# EAGLE design IOPROTO96 (EAGLE 9.4.2)
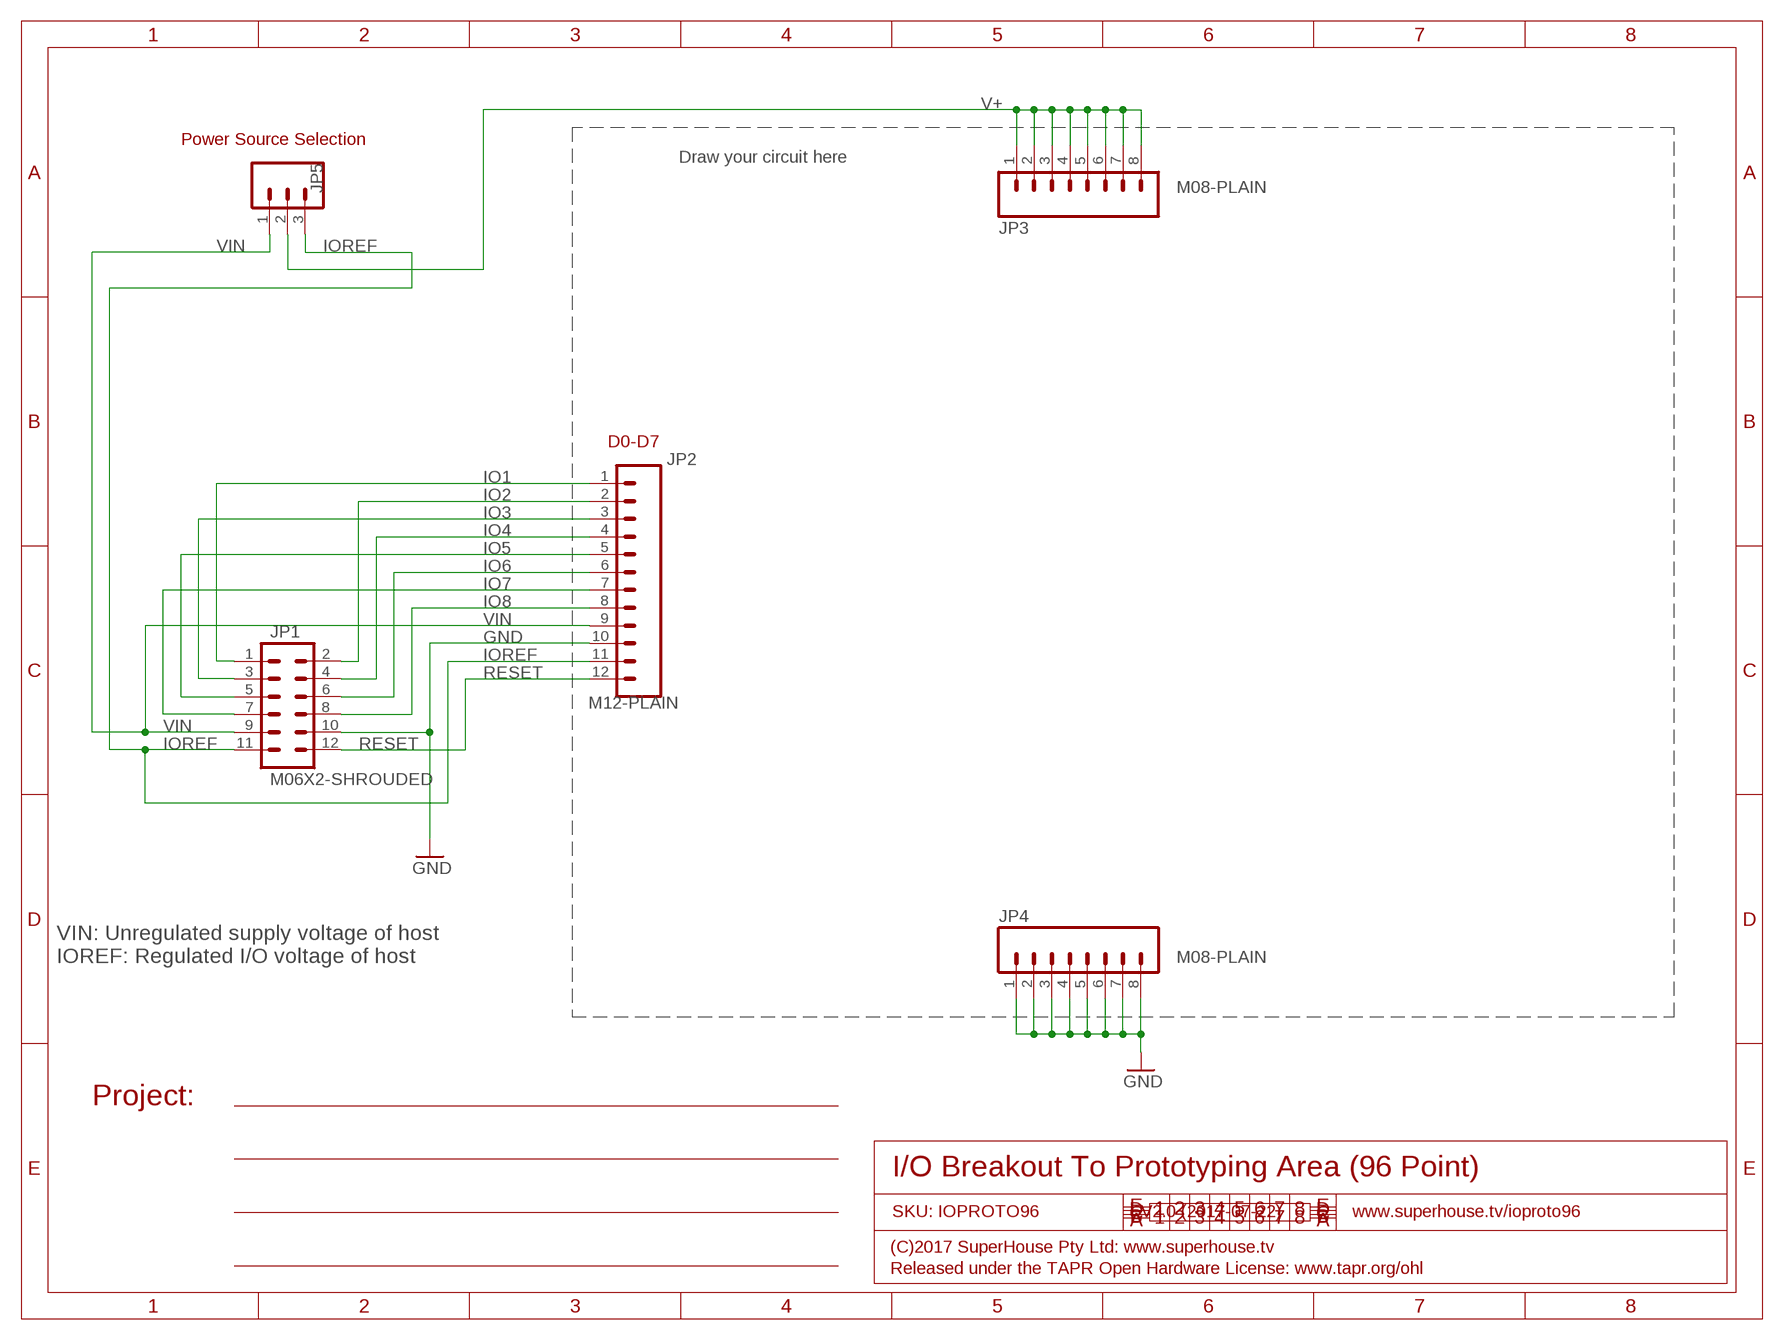
[diagram p0: schematic, sheet 1]

## Parts
JP1  M06X2-SHROUDED  [2X6-SHROUDED]
JP2  M12-PLAIN  [1X12]
JP3  M08-PLAIN  [1X08]
JP4  M08-PLAIN  [1X08]
JP5  M03-PIN  [1X03-P]

## Nets
GND: JP1.10 JP2.10 JP4.1 JP4.2 JP4.3 JP4.4 JP4.5 JP4.6 JP4.7 JP4.8
IO1: JP1.1 JP2.1
IO2: JP1.2 JP2.2
IO3: JP1.3 JP2.3
IO4: JP1.4 JP2.4
IO5: JP1.5 JP2.5
IO6: JP1.6 JP2.6
IO7: JP1.7 JP2.7
IO8: JP1.8 JP2.8
IOREF: JP1.11 JP2.11 JP5.3
RESET: JP1.12 JP2.12
V+: JP3.1 JP3.2 JP3.3 JP3.4 JP3.5 JP3.6 JP3.7 JP3.8 JP5.2
VIN: JP1.9 JP2.9 JP5.1

## Notes on the sheet
- Power Source Selection
- Draw your circuit here
- D0-D7
- VIN: Unregulated supply voltage of host
  IOREF: Regulated I/O voltage of host
- Project:
- I/O Breakout To Prototyping Area (96 Point)
- SKU: IOPROTO96 | V2.0 (2017-07-22) | www.superhouse.tv/ioproto96
- (C)2017 SuperHouse Pty Ltd: www.superhouse.tv
- Released under the TAPR Open Hardware License: www.tapr.org/ohl

## Library data of the parts
JP1 = SuperHouse-Connectors:M06X2: M12 header in 2x6 format
JP2 = SuperHouse-Connectors:M12: 12-way header
JP3 JP4 = SuperHouse-Connectors:M08
JP5 = SuperHouse-Connectors:M03: Header 1x5 Standard 0.1" header.

## Board
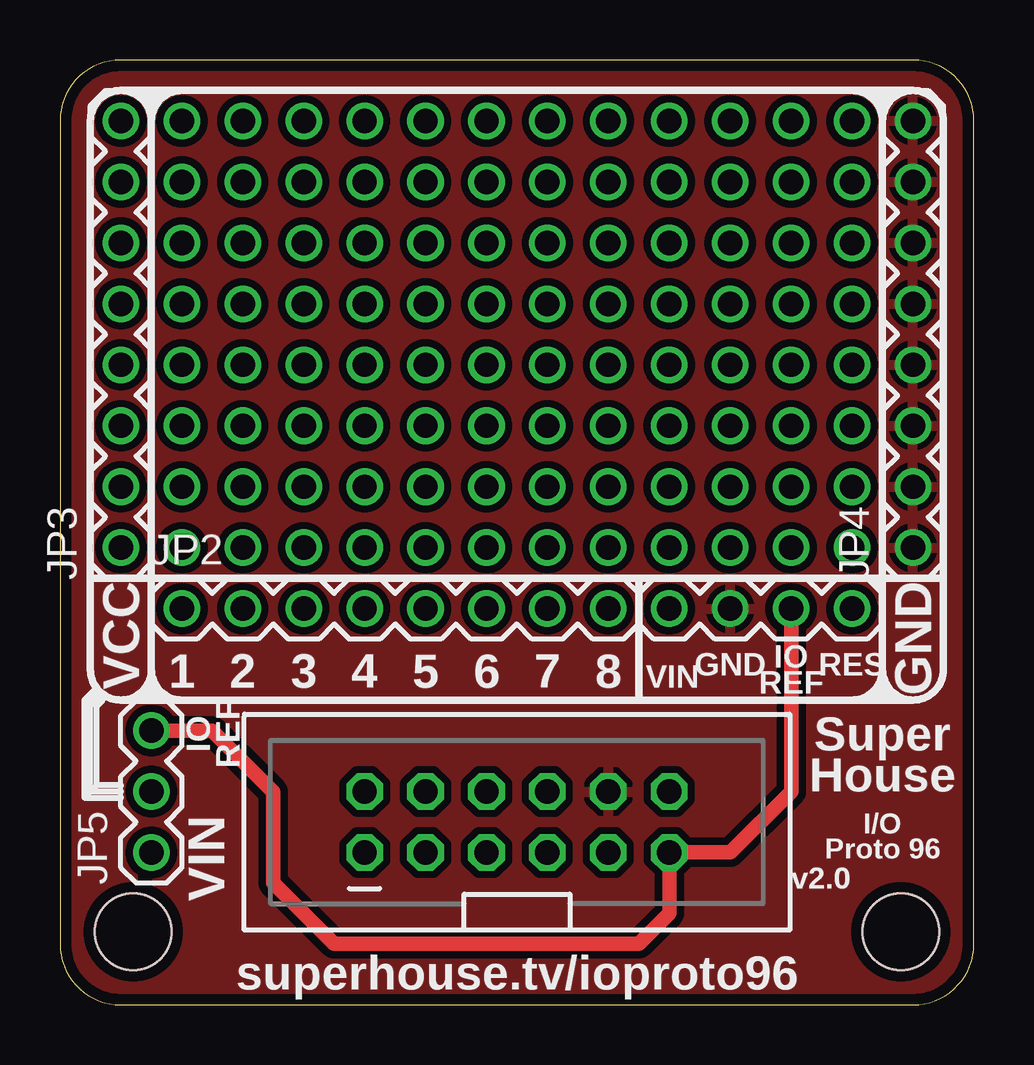
[diagram p1: board, top side]
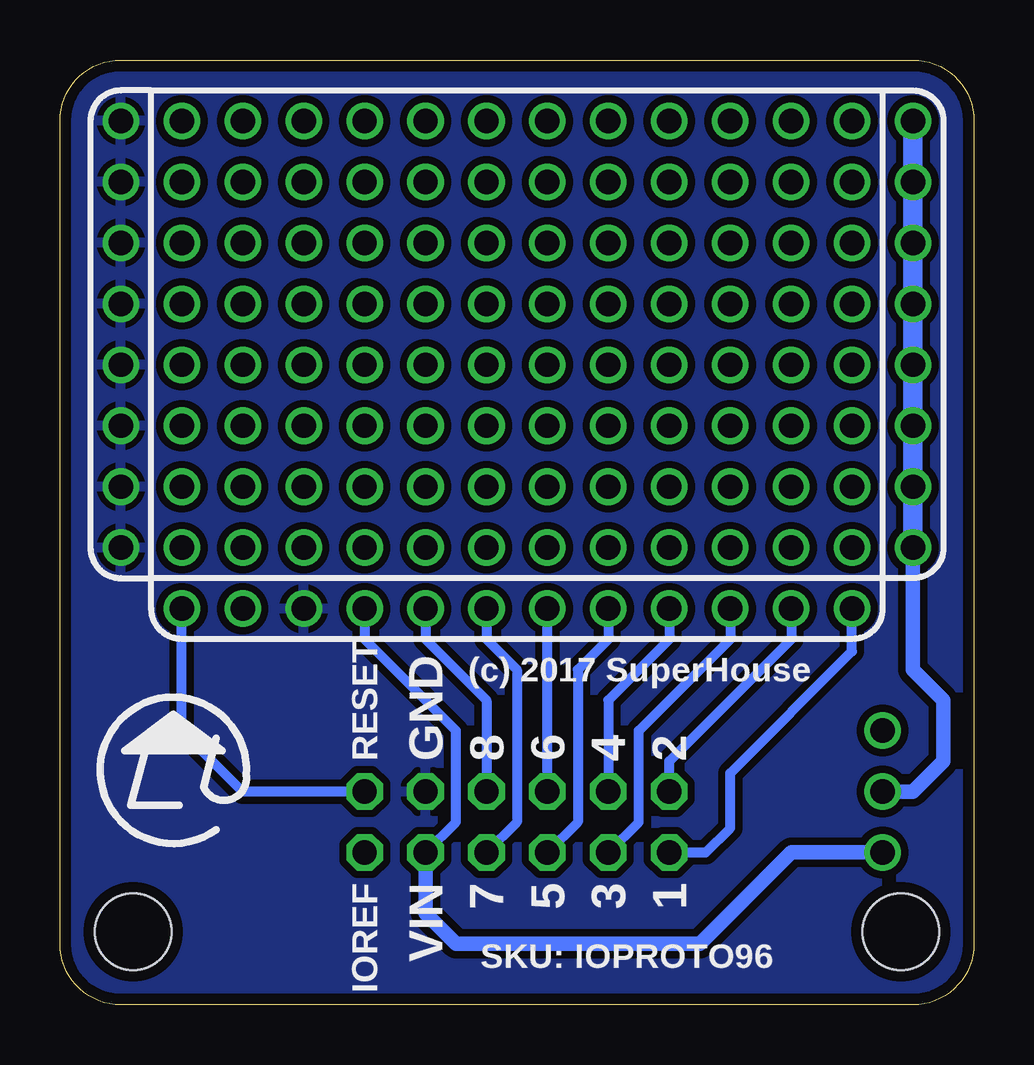
[diagram p2: board, bottom side, seen from below]

Size 38.1 x 39.37 mm. Coordinates in mm from the lower left corner, seen from the top.
Outline: 0,2.54 arc90 2.54,0 35.56,0 arc90 38.1,2.54 38.1,36.83 arc90 35.56,39.37 2.54,39.37 arc90 0,36.83 0,2.54
Copper layers (1*16): Top 0.035mm / dielectric 1.5mm / Bottom 0.035mm
Design rules "default *": minimum track width 10mil, minimum drill 24mil, track to track 12mil, track to pad 12mil, pad to pad 12mil, via to via 12mil, smd to smd 8mil, copper to edge 18mil, drill to drill 8mil, minimum pad ring 10mil, minimum via ring 6mil, stop-mask expansion 4mil, vias tented up to drill 25mil, thermal gap 10mil
Holes 3.2 mm at 35.05,3.05 3.05,3.05

### Footprints (pad centres in the part's own frame; a part is rotated, then mirrored left to right if it is on the bottom)
2X6-SHROUDED = drill 1.016 octagon: 1 0,0; 2 2.54,0; 3 0,-2.54; 4 2.54,-2.54; 5 0,-5.08; 6 2.54,-5.08; 7 0,-7.62; 8 2.54,-7.62; 9 0,-10.16; 10 2.54,-10.16; 11 0,-12.7; 12 2.54,-12.7
1X12 = drill 1.016: 1 0,0; 2 2.54,0; 3 5.08,0; 4 7.62,0; 5 10.16,0; 6 12.7,0; 7 15.24,0; 8 17.78,0; 9 20.32,0; 10 22.86,0; 11 25.4,0; 12 27.94,0
1X08 = drill 1.016: 1 0,0; 2 2.54,0; 3 5.08,0; 4 7.62,0; 5 10.16,0; 6 12.7,0; 7 15.24,0; 8 17.78,0
1X03-P = drill 1.016: 1 0,0; 2 2.54,0; 3 5.08,0

### Placement (x,y rotation side)
JP1  12.7,6.35 90 top
JP2  5.08,16.51 0 top
JP3  2.54,19.05 90 top
JP4  35.56,19.05 90 top
JP5  3.81,6.35 90 top

### Tracks (layer width: path | path; a pad name or v marks a point on that pad's centre or on a via)
GND
  pour Bottom: 0,36.83 arc-90 2.54,39.37 35.56,39.37 arc-90 38.1,36.83 38.1,2.54 arc-90 35.56,0 2.54,0 arc-90 0,2.54
  pour Top: 0,36.83 arc-90 2.54,39.37 35.56,39.37 arc-90 38.1,36.83 38.1,2.54 arc-90 35.56,0 2.54,0 arc-90 0,2.54
IO1
  Bottom 0.406: JP1.1 11.18,6.35 10.16,7.37 10.16,9.65 5.08,14.73 JP2.1
IO2
  Bottom 0.406: JP1.2 12.7,10.16 7.62,15.24 JP2.2
IO3
  Bottom 0.406: JP1.3 13.97,7.62 13.97,11.43 10.16,15.24 JP2.3
IO4
  Bottom 0.406: JP2.4 12.7,15.24 15.24,12.7 JP1.4
IO5
  Bottom 0.406: JP1.5 16.51,7.62 16.51,13.97 15.24,15.24 JP2.5
IO6
  Bottom 0.406: JP1.6 JP2.6
IO7
  Bottom 0.406: JP1.7 19.05,7.62 19.05,13.97 20.32,15.24 JP2.7
IO8
  Bottom 0.406: JP2.8 22.86,15.24 20.32,12.7 JP1.8
IOREF
  Top 0.61: JP2.11 30.48,8.89 27.94,6.35 JP1.11 25.4,3.81 24.13,2.54 11.43,2.54 8.89,5.08 8.89,8.89 6.35,11.43 JP5.3
N$1  (via drill 1.02)
  other vias: 5.08,19.05
N$2  (via drill 1.02)
  other vias: 10.16,19.05
N$3  (via drill 1.02)
  other vias: 12.7,19.05
N$4  (via drill 1.02)
  other vias: 15.24,19.05
N$5  (via drill 1.02)
  other vias: 17.78,19.05
N$6  (via drill 1.02)
  other vias: 20.32,19.05
N$7  (via drill 1.02)
  other vias: 22.86,19.05
N$8  (via drill 1.02)
  other vias: 25.4,19.05
N$9  (via drill 1.02)
  other vias: 27.94,19.05
N$10  (via drill 1.02)
  other vias: 30.48,19.05
N$15  (via drill 1.02)
  other vias: 27.94,21.59
N$16  (via drill 1.02)
  other vias: 25.4,21.59
N$17  (via drill 1.02)
  other vias: 22.86,21.59
N$18  (via drill 1.02)
  other vias: 20.32,21.59
N$19  (via drill 1.02)
  other vias: 17.78,21.59
N$20  (via drill 1.02)
  other vias: 15.24,21.59
N$21  (via drill 1.02)
  other vias: 12.7,21.59
N$22  (via drill 1.02)
  other vias: 10.16,21.59
N$23  (via drill 1.02)
  other vias: 10.16,24.13
N$24  (via drill 1.02)
  other vias: 12.7,24.13
N$25  (via drill 1.02)
  other vias: 15.24,24.13
N$26  (via drill 1.02)
  other vias: 17.78,24.13
N$31  (via drill 1.02)
  other vias: 20.32,24.13
N$32  (via drill 1.02)
  other vias: 22.86,24.13
N$33  (via drill 1.02)
  other vias: 25.4,24.13
N$34  (via drill 1.02)
  other vias: 27.94,24.13
N$35  (via drill 1.02)
  other vias: 30.48,24.13
N$36  (via drill 1.02)
  other vias: 30.48,21.59
N$37  (via drill 1.02)
  other vias: 30.48,26.67
N$38  (via drill 1.02)
  other vias: 30.48,29.21
N$39  (via drill 1.02)
  other vias: 30.48,31.75
N$40  (via drill 1.02)
  other vias: 30.48,34.29
N$41  (via drill 1.02)
  other vias: 27.94,34.29
N$42  (via drill 1.02)
  other vias: 27.94,31.75
N$43  (via drill 1.02)
  other vias: 27.94,29.21
N$44  (via drill 1.02)
  other vias: 27.94,26.67
N$45  (via drill 1.02)
  other vias: 25.4,26.67
N$46  (via drill 1.02)
  other vias: 22.86,26.67
N$47  (via drill 1.02)
  other vias: 20.32,26.67
N$48  (via drill 1.02)
  other vias: 17.78,26.67
N$49  (via drill 1.02)
  other vias: 15.24,26.67
N$50  (via drill 1.02)
  other vias: 12.7,26.67
N$51  (via drill 1.02)
  other vias: 10.16,26.67
N$52  (via drill 1.02)
  other vias: 7.62,26.67
N$53  (via drill 1.02)
  other vias: 7.62,24.13
N$54  (via drill 1.02)
  other vias: 7.62,21.59
N$55  (via drill 1.02)
  other vias: 7.62,29.21
N$56  (via drill 1.02)
  other vias: 7.62,31.75
N$57  (via drill 1.02)
  other vias: 7.62,34.29
N$58  (via drill 1.02)
  other vias: 10.16,34.29
N$59  (via drill 1.02)
  other vias: 12.7,34.29
N$60  (via drill 1.02)
  other vias: 15.24,34.29
N$61  (via drill 1.02)
  other vias: 17.78,34.29
N$62  (via drill 1.02)
  other vias: 20.32,34.29
N$63  (via drill 1.02)
  other vias: 22.86,34.29
N$64  (via drill 1.02)
  other vias: 25.4,34.29
N$65  (via drill 1.02)
  other vias: 25.4,31.75
N$66  (via drill 1.02)
  other vias: 25.4,29.21
N$67  (via drill 1.02)
  other vias: 22.86,29.21
N$68  (via drill 1.02)
  other vias: 20.32,29.21
N$69  (via drill 1.02)
  other vias: 17.78,29.21
N$70  (via drill 1.02)
  other vias: 15.24,29.21
N$71  (via drill 1.02)
  other vias: 12.7,29.21
N$72  (via drill 1.02)
  other vias: 10.16,29.21
N$73  (via drill 1.02)
  other vias: 10.16,31.75
N$74  (via drill 1.02)
  other vias: 12.7,31.75
N$75  (via drill 1.02)
  other vias: 15.24,31.75
N$76  (via drill 1.02)
  other vias: 17.78,31.75
N$77  (via drill 1.02)
  other vias: 20.32,31.75
N$78  (via drill 1.02)
  other vias: 22.86,31.75
N$79  (via drill 1.02)
  other vias: 7.62,36.83
N$80  (via drill 1.02)
  other vias: 10.16,36.83
N$81  (via drill 1.02)
  other vias: 12.7,36.83
N$82  (via drill 1.02)
  other vias: 15.24,36.83
N$83  (via drill 1.02)
  other vias: 17.78,36.83
N$84  (via drill 1.02)
  other vias: 20.32,36.83
N$85  (via drill 1.02)
  other vias: 22.86,36.83
N$86  (via drill 1.02)
  other vias: 25.4,36.83
N$87  (via drill 1.02)
  other vias: 27.94,36.83
N$88  (via drill 1.02)
  other vias: 30.48,36.83
N$89  (via drill 1.02)
  other vias: 33.02,36.83
N$90  (via drill 1.02)
  other vias: 33.02,34.29
N$91  (via drill 1.02)
  other vias: 33.02,31.75
N$92  (via drill 1.02)
  other vias: 33.02,29.21
N$93  (via drill 1.02)
  other vias: 33.02,26.67
N$94  (via drill 1.02)
  other vias: 33.02,24.13
N$95  (via drill 1.02)
  other vias: 33.02,21.59
N$96  (via drill 1.02)
  other vias: 33.02,19.05
N$97  (via drill 1.02)
  other vias: 5.08,36.83
N$98  (via drill 1.02)
  other vias: 5.08,34.29
N$99  (via drill 1.02)
  other vias: 5.08,31.75
N$100  (via drill 1.02)
  other vias: 5.08,29.21
N$101  (via drill 1.02)
  other vias: 5.08,26.67
N$102  (via drill 1.02)
  other vias: 5.08,24.13
N$103  (via drill 1.02)
  other vias: 5.08,21.59
N$104  (via drill 1.02)
  other vias: 7.62,19.05
RESET
  Bottom 0.406: JP1.12 30.48,8.89 33.02,11.43 JP2.12
V+
  Bottom 0.61: JP3.1 2.54,13.97 1.27,12.7 1.27,10.16 2.54,8.89 JP5.2
  Bottom 0.813: JP3.8 JP3.7 JP3.6 JP3.5 JP3.4 JP3.3 JP3.2 JP3.1
VIN
  Bottom 0.406: JP1.9 21.59,7.62 21.59,11.43 25.4,15.24 JP2.9
  Bottom 0.61: JP1.9 22.86,3.81 21.59,2.54 11.43,2.54 7.62,6.35 JP5.1

### Text on the board
tPlace: VCC | GND | GND | RES | 1 | 2 | 3 | 4 | 5 | 6 | 7 | 8 | VIN | IO / REF | IO / REF | Super / House | I/O / Proto 96 | v2.0 | VIN | superhouse.tv/ioproto96
bPlace: (c) 2017 SuperHouse | 2 | 4 | 6 | 8 | GND | RESET | 1 | 3 | 5 | 7 | VIN | IOREF | SKU: IOPROTO96
tValues: 100nF